# Altium project RF-UNIT-BIG-100W.PrjPcb
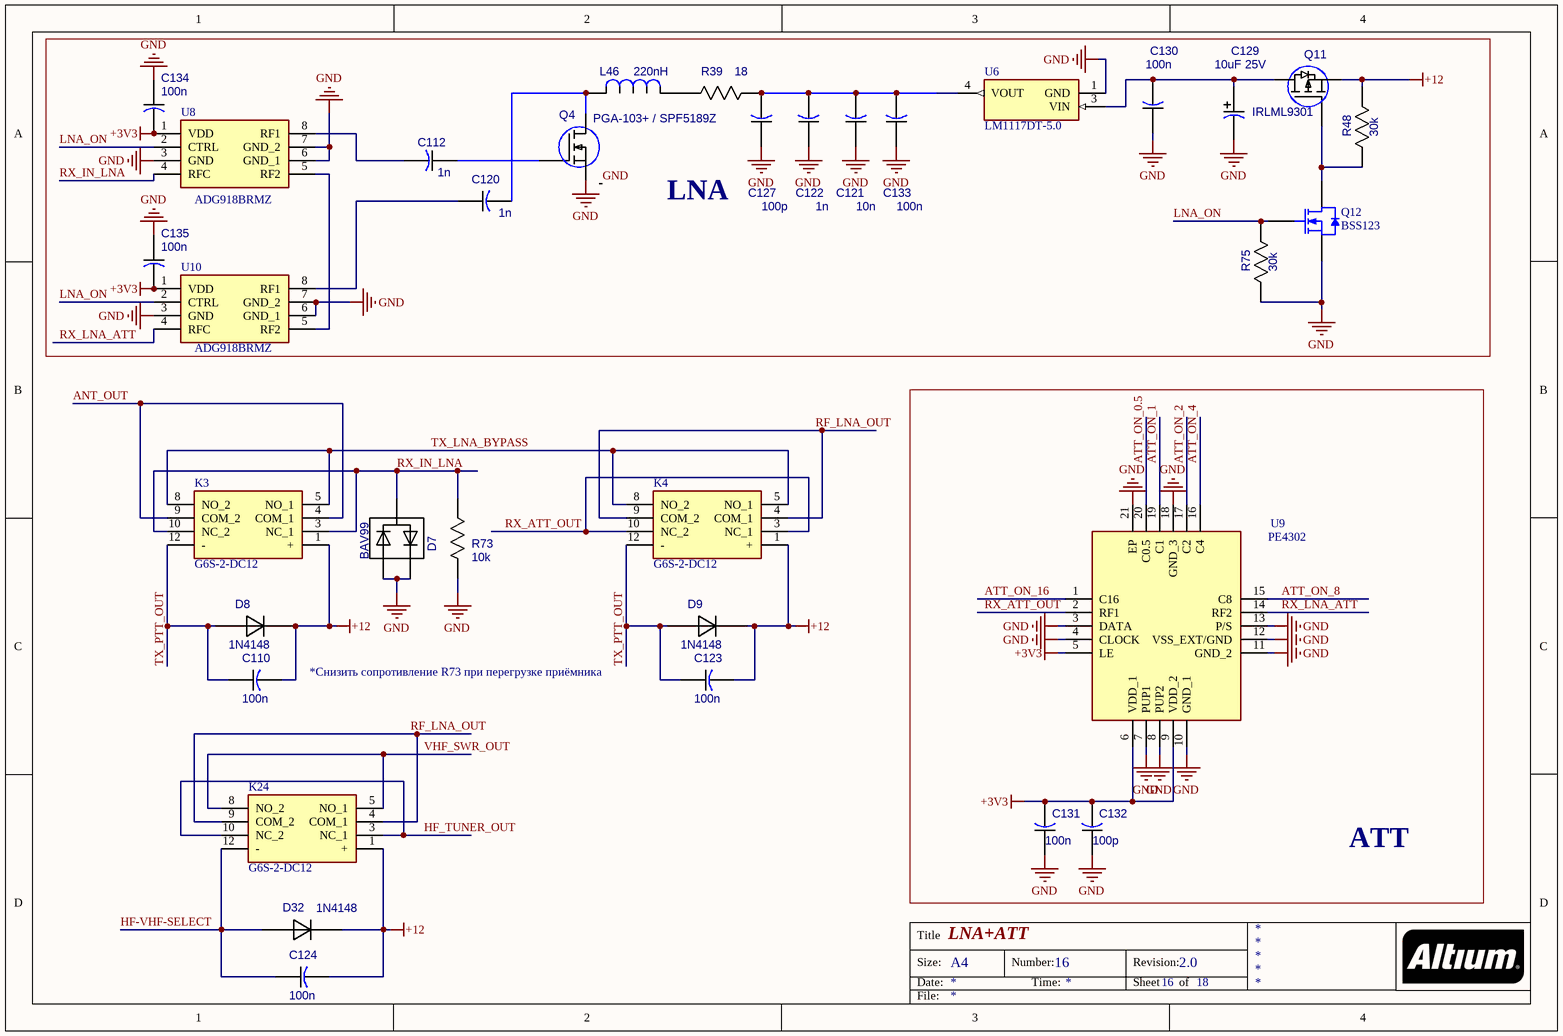
[diagram p0: LNA.SchDoc]
5 sheets, 215 parts. Net scope: global (net labels, ports and power ports of the same name join across sheets).
Board file: RF-UNIT-BIG-100W.PcbDoc
Sheets:
  LNA.SchDoc
  HF_TUNER.SchDoc
  HF_AMP.SchDoc
  HF_AMP_DRIVER.SchDoc
  VHF_AMP.SchDoc

## Sheet LNA.SchDoc: LNA+ATT
size A4; DocumentNumber: 16; Revision: 2.0; SheetNumber: 16; SheetTotal: 18

### Parts
C110  100n  [CAP_0805]
C112  1n  [CAP_0805]
C120  1n  [CAP_0805]
C121  10n  [6-0805_M]
C122  1n  [6-0805_M]
C123  100n  [CAP_0805]
C124  100n  [CAP_0805]
C127  100p  [6-0805_M]
C129  10uF 25V  [CAPAE_5.3x5.3h6.1]
C130  100n  [CAP_0805]
C131  100n  [6-0805_M]
C132  100p  [6-0805_M]
C133  100n  [CAP_0805]
C134  100n  [CAP_0805]
C135  100n  [CAP_0805]
D7  BAV99  [SOT23]
D8  1N4148  [SS14]
D9  1N4148  [SS14]
D32  1N4148  [SS14]
K3  G6S-2-DC12  [G6S2DC12]
K4  G6S-2-DC12  [G6S2DC12]
K24  G6S-2-DC12  [G6S2DC12]
L46  220nH  [IND_1206]
Q4  PGA-103+ / SPF5189Z  [SOT89]
Q11  IRLML9301  [SOT23]
Q12  BSS123  [FAIR-SOT23-3_V]
R39  18  [RES_1206]
R48  30k  [RES_0805]
R73  10k  [RES_1206]
R75  30k  [RES_0805]
U6  LM1117DT-5.0  [TO228P991X238-3N]
U8  ADG918BRMZ  [SOP65P490X110-8N]
U9  PE4302  [QFN50P400X400X90-21N]
U10  ADG918BRMZ  [SOP65P490X110-8N]

### Blocks framed on the sheet
LNA: C112 C120-C122 C127 C129 C130 C133-C135 L46 Q4 Q11 Q12 R39 R48 R75 U6 U8 U10
ATT: C131 C132 U9

### Nets
+3V3: C131.2 C132.2 C134.2 C135.2 U8.1(VDD) U9.5(LE) U9.6(VDD_1) U9.9(VDD_2) U10.1(VDD)
GND: C110.2 C121.1 C122.1 C123.2 C124.2 C127.1 C129.2(MINUS) C130.1 C131.1 C132.1 C133.1 C134.1 C135.1 D7.1(A(D1)) D7.2(C(D2)) D8.1(K) D9.1(K) D32.1(K) K3.1(+) K4.1(+) K24.1(+) Q4.0 Q4.2(S) Q11.2(S) Q12.2(S) R48.2 R73.1 R75.1 U6.1(GND) U8.3(GND) U8.6(GND_1) U8.7(GND_2) U9.3(DATA) U9.4(CLOCK) U9.7(PUP1) U9.8(PUP2) U9.10(GND_1) U9.11(GND_2) U9.12(VSS_EXT/GND) U9.13(P/S) U9.18(GND_3) U9.21(EP) U10.3(GND) U10.6(GND_1) U10.7(GND_2)  [also labelled +12]
ANT_OUT: K3.4(COM_1) K3.9(COM_2)
ATT_ON_0.5: U9.20(C0.5)
ATT_ON_1: U9.19(C1)
ATT_ON_2: U9.17(C2)
ATT_ON_4: U9.16(C4)
ATT_ON_8: U9.15(C8)
ATT_ON_16: U9.1(C16)
HF-VHF-SELECT: C124.1 D32.2(A) K24.12(-)
HF_TUNER_OUT: K24.3(NC_1) K24.10(NC_2)
LNA_ON: Q12.1(G) R75.2 U8.2(CTRL) U10.2(CTRL)
RF_LNA_OUT: K4.4(COM_1) K4.9(COM_2) K24.4(COM_1) K24.9(COM_2)
RX_ATT_OUT: K4.3(NC_1) K4.10(NC_2) U9.2(RF1)
RX_IN_LNA: D7.3(C(D1),A(D2)) K3.3(NC_1) K3.10(NC_2) R73.2 U8.4(RFC)
RX_LNA_ATT: U9.14(RF2) U10.4(RFC)
TX_LNA_BYPASS: K3.5(NO_1) K3.8(NO_2) K4.5(NO_1) K4.8(NO_2)
TX_PTT_OUT: C110.1 C123.1 D8.2(A) D9.2(A) K3.12(-) K4.12(-)
VHF_SWR_OUT: K24.5(NO_1) K24.8(NO_2)
NetC112_1: C112.1 Q4.1(G)
NetC112_2: C112.2 U8.8(RF1)
NetC120_1: C120.1 U10.8(RF1)
NetC120_2: C120.2 L46.2 Q4.3(D)
NetC121_2: C121.2 C122.2 C127.2 C133.2 R39.1 U6.4(VOUT)
NetC129_1: C129.1(PLUS) C130.2 Q11.3(D) U6.3(VIN)
NetL46_1: L46.1 R39.2
NetQ11_1: Q11.1(G) Q12.3(D) R48.1
NetU8_5: U8.5(RF2) U10.5(RF2)

### Notes on the sheet
- *Снизить сопротивление R73 при перегрузке приёмника
- Title
- Size:
- Date:
- A4
- Number:
- Time:
- Revision:
- Sheet
- of
- File:

### Library data of the parts
C110 C112 C120-C124 C127 C130-C135 = CAP_0805
  C121: Value: 10n
  C122: Value: 1n
  C127 C132: Value: 100p
  C130 C131 C133-C135: Value: 100n
C129 = CAPAE_5.3x5.3h6.1: Value: 10uF 25V
K3 K4 K24 = G6S-2-DC12: Relay or Contactor; Manufacturer_Name: Omron Electronics; Datasheet Link: https://componentsearchengine.com/Datasheets/1/G6S-2-DC12.pdf; Height: 9.4mm; Manufacturer_Part_Number: G6S-2-DC12; Mouser Part Number: 653-G6S-2-DC12A; Mouser Price/Stock: https://www.mouser.co.uk/ProductDetail/Omron-Electronics/G6S-2-DC12/?qs=QGk6feVlqMLN9Ouv0QsFzA%3D%3D
L46 = IND_1206: Value: 220nH
Q4 = PGA-103+
Q11 = MOSFET_ENH_PD: MOSFET; Value: IRLML9301
Q12 = CMP-2000-04934-1: N-Channel Logic Level Enhancement Mode Field Effect Transistor, 1.7 V, -55 to 150 degC, 3-Pin SOT-23, RoHS, Tape and Reel; Manufacturer: Fairchild; Channel Type: N; Typical Turn-Off Delay Time: 17ns; Maximum Continuous Drain Current: 0.17A; Rad Hard: No; Typical Rise Time: 9ns; Typical Fall Time: 2.4ns; Maximum Gate Source Voltage: ±20V; Maximum Drain Source Voltage: 100V; Typical Turn-On Delay Time: 1.7ns; RDS-on: 6000@10VmOhm; Package Version: Rev. 12, 03/2016; Packaging: Tape&Reel; Package Reference: SOT23-3; Channel Mode: Enhancement; Operating Temperature: -55to150degC; Package Description: 3-Pin Small Outline Transistor, Body 2.92 x 1.325 mm, Pitch 0.95 mm; Category: MOSFET; Datasheet Version: Jun-03; Datasheet URL: https://www.fairchildsemi.com/datasheets/BS/BSS123.pdf; Manufacturer URL: https://www.fairchildsemi.com/; Mounting: SurfaceMount; Package: 3SOT-23; Package URL: http://www.fairchildsemi.com/dwg/MA/MA03D.pdf
R39 R73 = RES_1206
  R39: Value: 18
R48 R75 = RES_0805: Value: 30k
U6 = LM1117DT-ADJ: Integrated Circuit; Manufacturer_Name: Texas Instruments; Datasheet Link: http://www.ti.com/lit/ds/symlink/lm1117-n.pdf; Height: 2.38mm; Manufacturer_Part_Number: LM1117DT-ADJ; Mouser Part Number: 926-LM1117DT-ADJ; Mouser Price/Stock: https://www.mouser.com/Search/Refine.aspx?Keyword=926-LM1117DT-ADJ
U8 U10 = ADG918BRMZ: Integrated Circuit; Manufacturer_Name: Analog Devices; Datasheet Link: http://www.analog.com/static/imported-files/data_sheets/ADG918_919.pdf; Height: 1.1mm; Manufacturer_Part_Number: ADG918BRMZ; Mouser Part Number: 584-ADG918BRMZ; Mouser Price/Stock: https://www.mouser.co.uk/ProductDetail/Analog-Devices/ADG918BRMZ?qs=BpaRKvA4VqHrp1TCwMhfnw%3D%3D; RS Part Number: 4969212P; RS Price/Stock: http://uk.rs-online.com/web/p/products/4969212P
U9 = PE4312C-Z: Integrated Circuit; Manufacturer_Name: pSemi; Datasheet Link: https://www.psemi.com/pdf/datasheets/pe4312ds.pdf; Height: 0.9mm; Manufacturer_Part_Number: PE4312C-Z; Mouser Part Number: N/A; Mouser Price/Stock: https://www.mouser.com/Search/Refine.aspx?Keyword=N%2FA
D7 = BAV99: Value: BAV99
D8 D9 D32 = 1N4148: Value: *

## Sheet HF_TUNER.SchDoc: HF Tuner
size A4 portrait; DocumentNumber: 18; Revision: 2.0; SheetNumber: 18; SheetTotal: 18
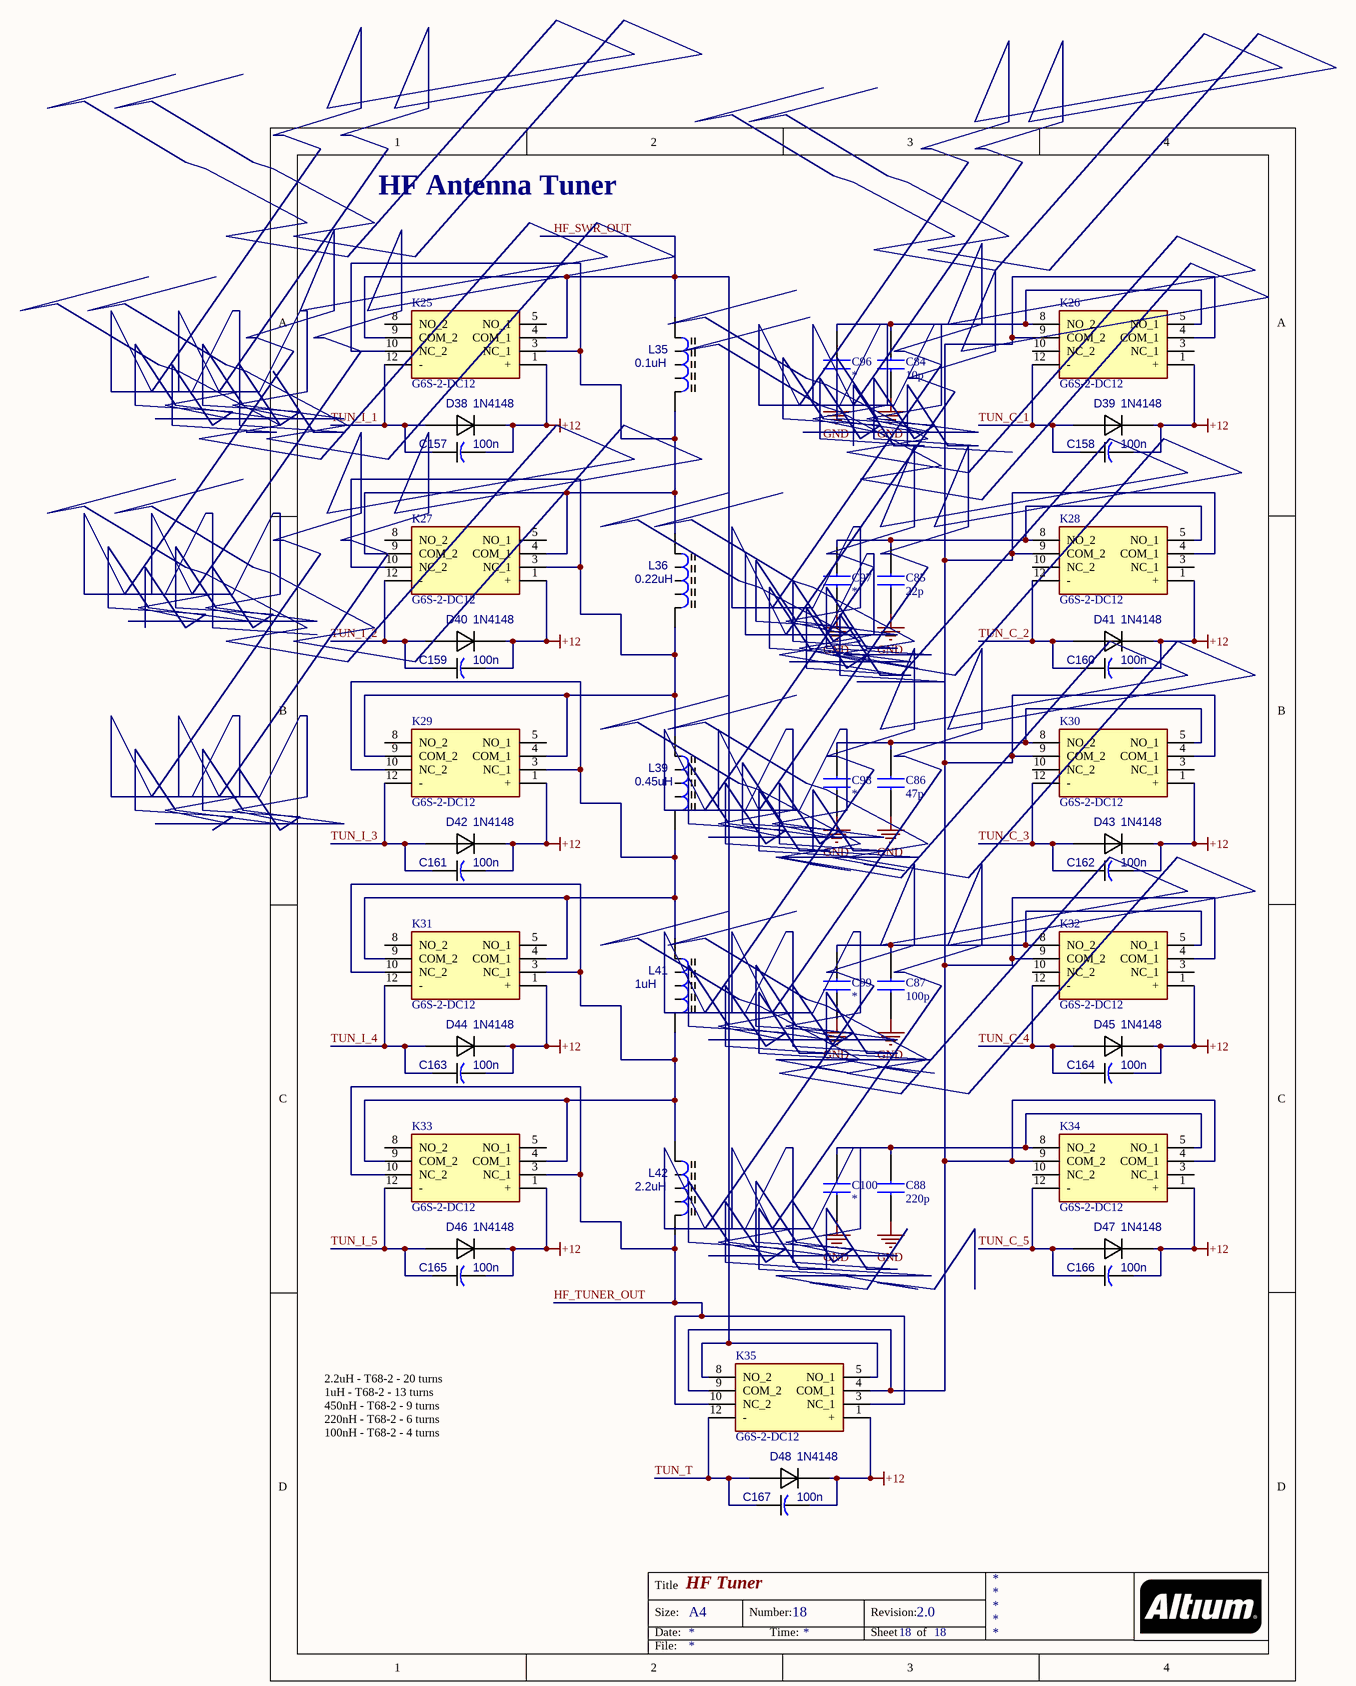
[diagram p1: HF_TUNER.SchDoc]

### Parts
C84  10p  [B32620A0682J000]
C85  22p  [B32620A0682J000]
C86  47p  [B32620A0682J000]
C87  100p  [B32620A0682J000]
C88  220p  [B32620A0682J000]
C96  *  [CAP_1206]
C97  *  [CAP_1206]
C98  *  [CAP_1206]
C99  *  [CAP_1206]
C100  *  [CAP_1206]
C157  100n  [CAP_0805]
C158  100n  [CAP_0805]
C159  100n  [CAP_0805]
C160  100n  [CAP_0805]
C161  100n  [CAP_0805]
C162  100n  [CAP_0805]
C163  100n  [CAP_0805]
C164  100n  [CAP_0805]
C165  100n  [CAP_0805]
C166  100n  [CAP_0805]
C167  100n  [CAP_0805]
D38  1N4148  [SS14]
D39  1N4148  [SS14]
D40  1N4148  [SS14]
D41  1N4148  [SS14]
D42  1N4148  [SS14]
D43  1N4148  [SS14]
D44  1N4148  [SS14]
D45  1N4148  [SS14]
D46  1N4148  [SS14]
D47  1N4148  [SS14]
D48  1N4148  [SS14]
K25  G6S-2-DC12  [G6S2DC12]
K26  G6S-2-DC12  [G6S2DC12]
K27  G6S-2-DC12  [G6S2DC12]
K28  G6S-2-DC12  [G6S2DC12]
K29  G6S-2-DC12  [G6S2DC12]
K30  G6S-2-DC12  [G6S2DC12]
K31  G6S-2-DC12  [G6S2DC12]
K32  G6S-2-DC12  [G6S2DC12]
K33  G6S-2-DC12  [G6S2DC12]
K34  G6S-2-DC12  [G6S2DC12]
K35  G6S-2-DC12  [G6S2DC12]
L35  0.1uH  [IND_FERRITE_CORE_1]
L36  0.22uH  [IND_FERRITE_CORE_1]
L39  0.45uH  [IND_FERRITE_CORE_1]
L41  1uH  [IND_FERRITE_CORE_1]
L42  2.2uH  [IND_FERRITE_CORE_1]

### Nets
GND: C84.1 C84.2 C85.1 C86.1 C87.1 C87.2 C88.1 C88.2 C96.1 C96.2 C97.1 C98.1 C99.1 C99.2 C100.1 C100.2 C157.1 C157.2 C158.2 C159.2 C160.2 C161.2 C162.2 C163.2 C164.2 C165.2 C166.2 C167.2 D38.1(K) D38.2(A) D39.1(K) D40.1(K) D41.1(K) D42.1(K) D43.1(K) D44.1(K) D45.1(K) D46.1(K) D47.1(K) D48.1(K) K25.1(+) K25.3(NC_1) K25.4(COM_1) K25.9(COM_2) K25.10(NC_2) K25.12(-) K26.1(+) K26.4(COM_1) K26.5(NO_1) K26.8(NO_2) K26.9(COM_2) K27.1(+) K27.3(NC_1) K27.4(COM_1) K27.9(COM_2) K27.10(NC_2) K28.1(+) K28.4(COM_1) K28.9(COM_2) K29.1(+) K29.4(COM_1) K29.9(COM_2) K30.1(+) K30.4(COM_1) K30.9(COM_2) K31.1(+) K32.1(+) K32.4(COM_1) K32.5(NO_1) K32.8(NO_2) K32.9(COM_2) K33.1(+) K34.1(+) K34.4(COM_1) K34.5(NO_1) K34.8(NO_2) K34.9(COM_2) K35.1(+) K35.4(COM_1) K35.5(NO_1) K35.8(NO_2) K35.9(COM_2) L35.1(A) L35.2(B) L36.1(A) L36.2(B) L39.1(A)  [also labelled +12, HF_SWR_OUT, TUN_I_1]
HF_TUNER_OUT: K33.3(NC_1) K33.10(NC_2) K35.3(NC_1) K35.10(NC_2) L42.2(B)
TUN_I_2: C159.1 D40.2(A) K27.12(-)
TUN_I_3: C161.1 D42.2(A) K29.12(-)
TUN_I_4: C163.1 D44.2(A) K31.12(-)
TUN_I_5: C165.1 D46.2(A) K33.12(-)
TUN_T: C167.1 D48.2(A) K35.12(-)
TUN_С_1: C158.1 D39.2(A) K26.12(-)
TUN_С_2: C160.1 D41.2(A) K28.12(-)
TUN_С_3: C162.1 D43.2(A) K30.12(-)
TUN_С_4: C164.1 D45.2(A) K32.12(-)
TUN_С_5: C166.1 D47.2(A) K34.12(-)
NetC85_2: C85.2 C97.2 K28.5(NO_1) K28.8(NO_2)
NetC86_2: C86.2 C98.2 K30.5(NO_1) K30.8(NO_2)
NetK29_3: K29.3(NC_1) K29.10(NC_2) K31.4(COM_1) K31.9(COM_2) L39.2(B) L41.1(A)
NetK31_3: K31.3(NC_1) K31.10(NC_2) K33.4(COM_1) K33.9(COM_2) L41.2(B) L42.1(A)

Not connected (* = marked no-connect by the designer): K25 5(NO_1) 8(NO_2); K26 3(NC_1) 10(NC_2); K27 5(NO_1) 8(NO_2); K28 3(NC_1) 10(NC_2); K29 5(NO_1) 8(NO_2); K30 3(NC_1) 10(NC_2); K31 5(NO_1) 8(NO_2); K32 3(NC_1) 10(NC_2); K33 5(NO_1) 8(NO_2); K34 3(NC_1) 10(NC_2)

### Notes on the sheet
- HF Antenna Tuner
- 2.2uH - T68-2 - 20 turns
  1uH - T68-2 - 13 turns
  450nH - T68-2 - 9 turns
  220nH - T68-2 - 6 turns
  100nH - T68-2 - 4 turns
- Title
- Size:
- Date:
- A4
- Number:
- Time:
- Revision:
- Sheet
- of
- File:

### Library data of the parts
C84-C88 = B32620A0682J000: Capacitor; Manufacturer_Name: TDK; Datasheet Link: https://www.tdk-electronics.tdk.com/inf/20/20/db/fc_2009/MKP_B32620_621.pdf; Height: 12mm; Manufacturer_Part_Number: B32620A0682J000; Mouser Part Number: 871-B32620A682J; Mouser Price/Stock: https://www.mouser.com/Search/Refine.aspx?Keyword=871-B32620A682J
C96-C100 = B32620A0682J000: Capacitor NP0 HiVolt; Manufacturer_Name: TDK; Datasheet Link: https://www.tdk-electronics.tdk.com/inf/20/20/db/fc_2009/MKP_B32620_621.pdf; Height: 12mm; Manufacturer_Part_Number: B32620A0682J000; Mouser Part Number: 871-B32620A682J; Mouser Price/Stock: https://www.mouser.com/Search/Refine.aspx?Keyword=871-B32620A682J
C157-C167 = CAP_0805
K25-K35 = G6S-2-DC12: as K3 on sheet LNA; Datasheet Link: https://componentsearchengine.com/Datasheets/1/G6S-2-DC12.pdf; Height: 9.4mm; Manufacturer_Part_Number: G6S-2-DC12; Mouser Part Number: 653-G6S-2-DC12A; Mouser Price/Stock: https://www.mouser.co.uk/ProductDetail/Omron-Electronics/G6S-2-DC12/?qs=QGk6feVlqMLN9Ouv0QsFzA%3D%3D
L35 L36 L39 L41 L42 = IND_FERRITE_CORE: Inductor
D38-D48 = 1N4148: Value: *

## Sheet HF_AMP.SchDoc: HF RF AMP
size A4; DocumentNumber: 17; Revision: 2.0; SheetNumber: 17; SheetTotal: 18
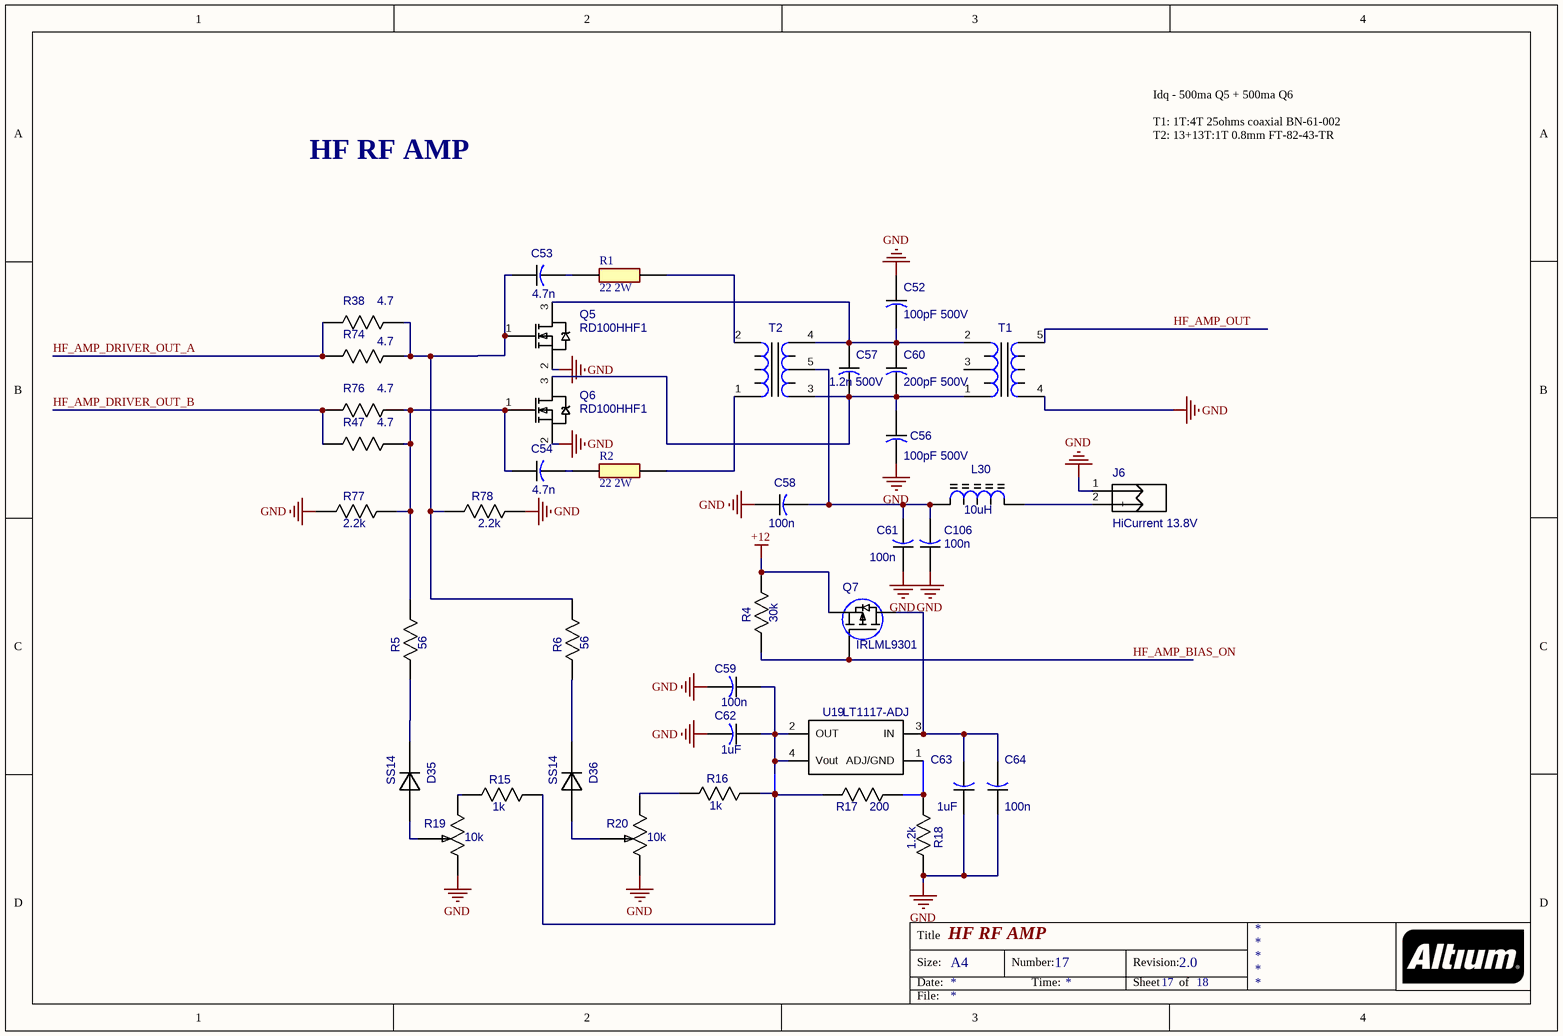
[diagram p2: HF_AMP.SchDoc]

### Parts
C52  100pF 500V  [CAP_1206]
C53  4.7n  [CAP_1206]
C54  4.7n  [CAP_1206]
C56  100pF 500V  [CAP_1206]
C57  1.2n 500V  [CAP_1206]
C58  100n  [CAP_1206]
C59  100n  [CAP_0805]
C60  200pF 500V  [CAP_1206]
C61  100n  [CAP_1206]
C62  1uF  [CAP_0805]
C63  1uF  [CAP_0805]
C64  100n  [CAP_0805]
C106  100n  [CAP_1206]
D35  SS14  [SS14]
D36  SS14  [SS14]
J6  HiCurrent 13.8V  [1986717-2]
L30  10uH  [IND_FERRITE_CORE]
Q5  RD100HHF1  [RD100_V2]
Q6  RD100HHF1  [RD100_V2]
Q7  IRLML9301  [SOT23]
R1  22 2W  [RES-2W]
R2  22 2W  [RES-2W]
R4  30k  [RES_0805]
R5  56  [RES_0805]
R6  56  [RES_0805]
R15  1k  [RES_0805]
R16  1k  [RES_0805]
R17  200  [RES_0805]
R18  1.2k  [RES_0805]
R19  value 10k  [306J]  (hidden comment: ADJ-10k)
R20  value 10k  [306J]  (hidden comment: ADJ-10k)
R38  4.7  [RES_1206]
R47  4.7  [RES_1206]
R74  4.7  [RES_1206]
R76  4.7  [RES_1206]
R77  2.2k  [RES_0805]
R78  2.2k  [RES_0805]
T1  TRANSF_HF2  [TRANSF_HF2-3]  (value not drawn)
T2  TRANSF_HF1  [TRANSF_HF1]  (value not drawn)
U19  value LT1117-ADJ  [LT1117IST-ADJ]  (hidden comment: LT1117IST-ADJ)

### Nets
GND: C52.1 C56.2 C58.1 C59.2 C61.1 C62.2 C63.1 C64.1 C106.1 J6.1(-) Q5.2(S) Q6.2(S) Q7.2(S) R4.2 R18.2 R19.1(CCW) R20.1(CCW) R77.1 R78.2 T1.4(S1)  [also labelled +12]
HF_AMP_BIAS_ON: Q7.1(G) R4.1
HF_AMP_DRIVER_OUT_A: R38.1 R74.1
HF_AMP_DRIVER_OUT_B: R47.1 R76.1
HF_AMP_OUT: T1.5(S2)
NetC52_2: C52.2 C57.1 C60.1 Q5.3(D) T1.2(P2) T2.4(S2)
NetC53_1: C53.1 Q5.1(G) R6.2 R38.2 R74.2 R78.1
NetC53_2: C53.2 R1.1
NetC54_1: C54.1 Q6.1(G) R5.2 R47.2 R76.2 R77.2
NetC54_2: C54.2 R2.1
NetC56_1: C56.1 C57.2 C60.2 Q6.3(D) T1.1(P1) T2.3(S1)
NetC58_2: C58.2 C61.2 C106.2 L30.1(A) T2.5(S3)
NetC59_1: C59.1 C62.1 R15.2 R16.2 R17.1 U19.2(OUT) U19.4(Vout)
NetC63_2: C63.2 C64.2 Q7.3(D) U19.3(IN)
NetD35_1: D35.1(K) R5.1
NetD35_2: D35.2(A) R19.2(W)
NetD36_1: D36.1(K) R6.1
NetD36_2: D36.2(A) R20.2(W)
NetJ6_2: J6.2(+) L30.2(B)
NetR1_2: R1.2 T2.2(P2)
NetR2_2: R2.2 T2.1(P1)
NetR15_1: R15.1 R19.3(CW)
NetR16_1: R16.1 R20.3(CW)
NetR17_2: R17.2 R18.1 U19.1(ADJ/GND)

Not connected (* = marked no-connect by the designer): T1 3(P3)

### Notes on the sheet
- HF RF AMP
- Idq - 500ma Q5 + 500ma Q6
  T1: 1T:4T 25ohms coaxial BN-61-002
  T2: 13+13T:1T 0.8mm FT-82-43-TR
- Title
- Size:
- Date:
- A4
- Number:
- Time:
- Revision:
- Sheet
- of
- File:

### Library data of the parts
C52-C54 C56-C58 C60 C61 C106 = CAP_1206
C59 C62-C64 = CAP_0805
  C59 C64: Value: 100n
  C62 C63: Value: 1uF
J6 = 1986717-2: JX2
L30 = IND_FERRITE_CORE: Inductor; Value: 10uH
Q7 = MOSFET_ENH_PD: MOSFET; Value: IRLML9301
R1 R2 = CFR200J100R: Manufacturer_Name: TE Connectivity; Datasheet Link: http://www.te.com/commerce/DocumentDelivery/DDEController?Action=showdoc&DocId=Data+Sheet%7F1773195%7FE%7Fpdf%7FEnglish%7FENG_DS_1773195_E.pdf%7F1623929-2; Manufacturer_Part_Number: CFR200J100R; Mouser Part Number: 279-CFR200J100R; Mouser Price/Stock: https://www.mouser.com/Search/Refine.aspx?Keyword=279-CFR200J100R; Arrow Part Number: CFR200J100R; Arrow Price/Stock: https://www.arrow.com/en/products/cfr200j100r/te-connectivity
R4-R6 R15-R18 R77 R78 = RES_0805
  R4: Value: 30k
  R5 R6: Value: 56
  R15 R16: Value: 1k
  R17: Value: 200
  R18: Value: 1.2k
R19 R20 = 306J
R38 R47 R74 R76 = RES_1206
T1 = TRANSF_RF2: Value: *
T2 = TRANSF_RF1: Value: *
D35 D36 = SS14: Value: SS14
Q5 Q6 = RD100HHF1: Value: RD100HHF1

## Sheet HF_AMP_DRIVER.SchDoc: HF RF AMP DRIVER
size A4; DocumentNumber: 17; Revision: 2.0; SheetNumber: 17; SheetTotal: 18
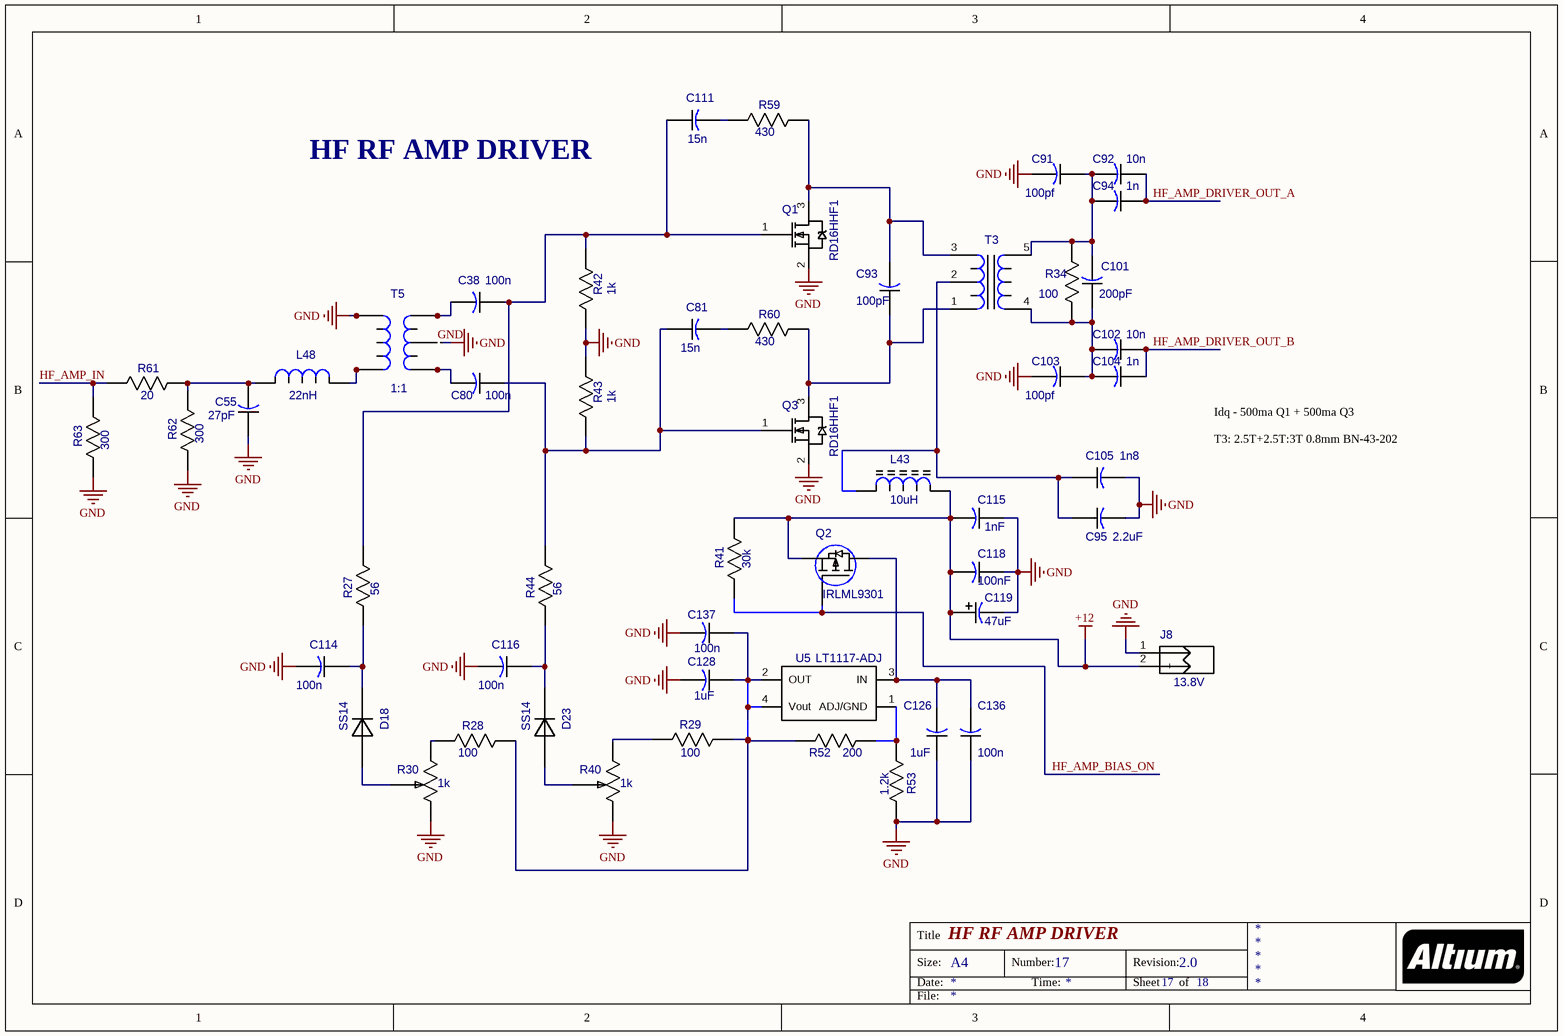
[diagram p3: HF_AMP_DRIVER.SchDoc]

### Parts
C38  100n  [CAP_0805]
C55  27pF  [CAP_0805]
C80  100n  [CAP_0805]
C81  15n  [CAP_1206]
C91  100pf  [CAP_1206]
C92  10n  [CAP_1206]
C93  100pF  [CAP_1206]
C94  1n  [CAP_1206]
C95  2.2uF  [CAP_1206]
C101  200pF  [CAP_1206]
C102  10n  [CAP_1206]
C103  100pf  [CAP_1206]
C104  1n  [CAP_1206]
C105  1n8  [CAP_1206]
C111  15n  [CAP_1206]
C114  100n  [CAP_0805]
C115  1nF  [CAP_0805]
C116  100n  [CAP_0805]
C118  100nF  [CAP_0805]
C119  47uF  [CAPAE_6.6x6.6h5.4]
C126  1uF  [CAP_0805]
C128  1uF  [CAP_0805]
C136  100n  [CAP_0805]
C137  100n  [CAP_0805]
D18  SS14  [SS14]
D23  SS14  [SS14]
J8  13.8V  [1986717-2]
L43  10uH  [IND_FERRITE_CORE]
L48  22nH  [IND_0805]
Q1  RD16HHF1  [RD16_V2]
Q2  IRLML9301  [SOT23]
Q3  RD16HHF1  [RD16_V2]
R27  56  [RES_0805]
R28  100  [RES_0805]
R29  100  [RES_0805]
R30  value 1k  [306J]  (hidden comment: ADJ-1k)
R34  100  [RES_1206]
R40  value 1k  [306J]  (hidden comment: ADJ-1k)
R41  30k  [RES_0805]
R42  1k  [RES_0805]
R43  1k  [RES_0805]
R44  56  [RES_0805]
R52  200  [RES_0805]
R53  1.2k  [RES_0805]
R59  430  [RES_1206]
R60  430  [RES_1206]
R61  20  [RES_1206]
R62  300  [RES_1206]
R63  300  [RES_1206]
T3  TRANSF_HF3  [TRANSF_HF3]  (value not drawn)
T5  1:1  [TRANSF_ACORE2]
U5  value LT1117-ADJ  [LT1117IST-ADJ]  (hidden comment: LT1117IST-ADJ)

### Nets
GND: C55.1 C91.2 C95.2 C103.2 C105.2 C114.2 C115.1 C115.2 C116.2 C118.1 C118.2 C119.1(PLUS) C119.2(MINUS) C126.1 C128.2 C136.1 C137.2 J8.1(-) J8.2(+) L43.2(B) Q1.2(S) Q2.2(S) Q3.2(S) R30.1(CCW) R40.1(CCW) R41.2 R42.1 R43.2 R53.2 R62.1 R63.1 T5.2(S2) T5.4(P2) T5.8(S2) T5.11  [also labelled +12]
HF_AMP_BIAS_ON: Q2.1(G) R41.1
HF_AMP_DRIVER_OUT_A: C92.1 C94.1
HF_AMP_DRIVER_OUT_B: C102.1 C104.1
HF_AMP_IN: R61.1 R63.2
NetC38_1: C38.1 C111.1 Q1.1(G) R27.2 R42.2
NetC38_2: C38.2 T5.3(S3) T5.9
NetC55_2: C55.2 L48.1 R61.2 R62.2
NetC80_1: C80.1 C81.1 Q3.1(G) R43.1 R44.2
NetC80_2: C80.2 T5.1(S1) T5.7
NetC81_2: C81.2 R60.1
NetC91_1: C91.1 C92.2 C94.2 C101.2 R34.2 T3.5(P1)
NetC93_1: C93.1 Q3.3(D) R60.2 T3.1(S2)
NetC93_2: C93.2 Q1.3(D) R59.2 T3.3(S1)
NetC95_1: C95.1 C105.1 L43.1(A) T3.2(S3)
NetC101_1: C101.1 C102.2 C103.1 C104.2 R34.1 T3.4(P2)
NetC111_2: C111.2 R59.1
NetC114_1: C114.1 D18.1(K) R27.1
NetC116_1: C116.1 D23.1(K) R44.1
NetC126_2: C126.2 C136.2 Q2.3(D) U5.3(IN)
NetC128_1: C128.1 C137.1 R28.2 R29.2 R52.1 U5.2(OUT) U5.4(Vout)
NetD18_2: D18.2(A) R30.2(W)
NetD23_2: D23.2(A) R40.2(W)
NetL48_2: L48.2 T5.6(P1) T5.10
NetR28_1: R28.1 R30.3(CW)
NetR29_1: R29.1 R40.3(CW)
NetR52_2: R52.2 R53.1 U5.1(ADJ/GND)

### Notes on the sheet
- HF RF AMP DRIVER
- Idq - 500ma Q1 + 500ma Q3
  T3: 2.5T+2.5T:3T 0.8mm BN-43-202
- Title
- Size:
- Date:
- A4
- Number:
- Time:
- Revision:
- Sheet
- of
- File:

### Library data of the parts
C38 C55 C80 C114-C116 C118 C126 C128 C136 C137 = CAP_0805
  C114 C116 C136 C137: Value: 100n
  C115: Value: 1nF
  C118: Value: 100nF
  C126 C128: Value: 1uF
C81 C91-C95 C101-C105 C111 = CAP_1206
C119 = CAPAE_6.6x6.6h5.4: Value: 47uF
J8 = 1986717-2: JX2; Value: 13.8V
L43 = IND_FERRITE_CORE: Inductor; Value: 10uH
L48 = IND_0805
Q2 = MOSFET_ENH_PD: MOSFET; Value: IRLML9301
R27-R29 R41-R44 R52 R53 = RES_0805
  R27 R44: Value: 56
  R41: Value: 30k
  R42 R43: Value: 1k
  R52: Value: 200
  R53: Value: 1.2k
R30 R40 = 306J
R34 R59-R63 = RES_1206
T3 = TRANSF_RF3: Value: *
T5 = TRANSF_ACORE2: Value: 1:1
D18 D23 = SS14: Value: SS14
Q1 Q3 = RD16HHF1: Value: RD16HHF1

## Sheet VHF_AMP.SchDoc: VHF RF AMP
size A4; DocumentNumber: 17; Revision: 2.0; SheetNumber: 17; SheetTotal: 18
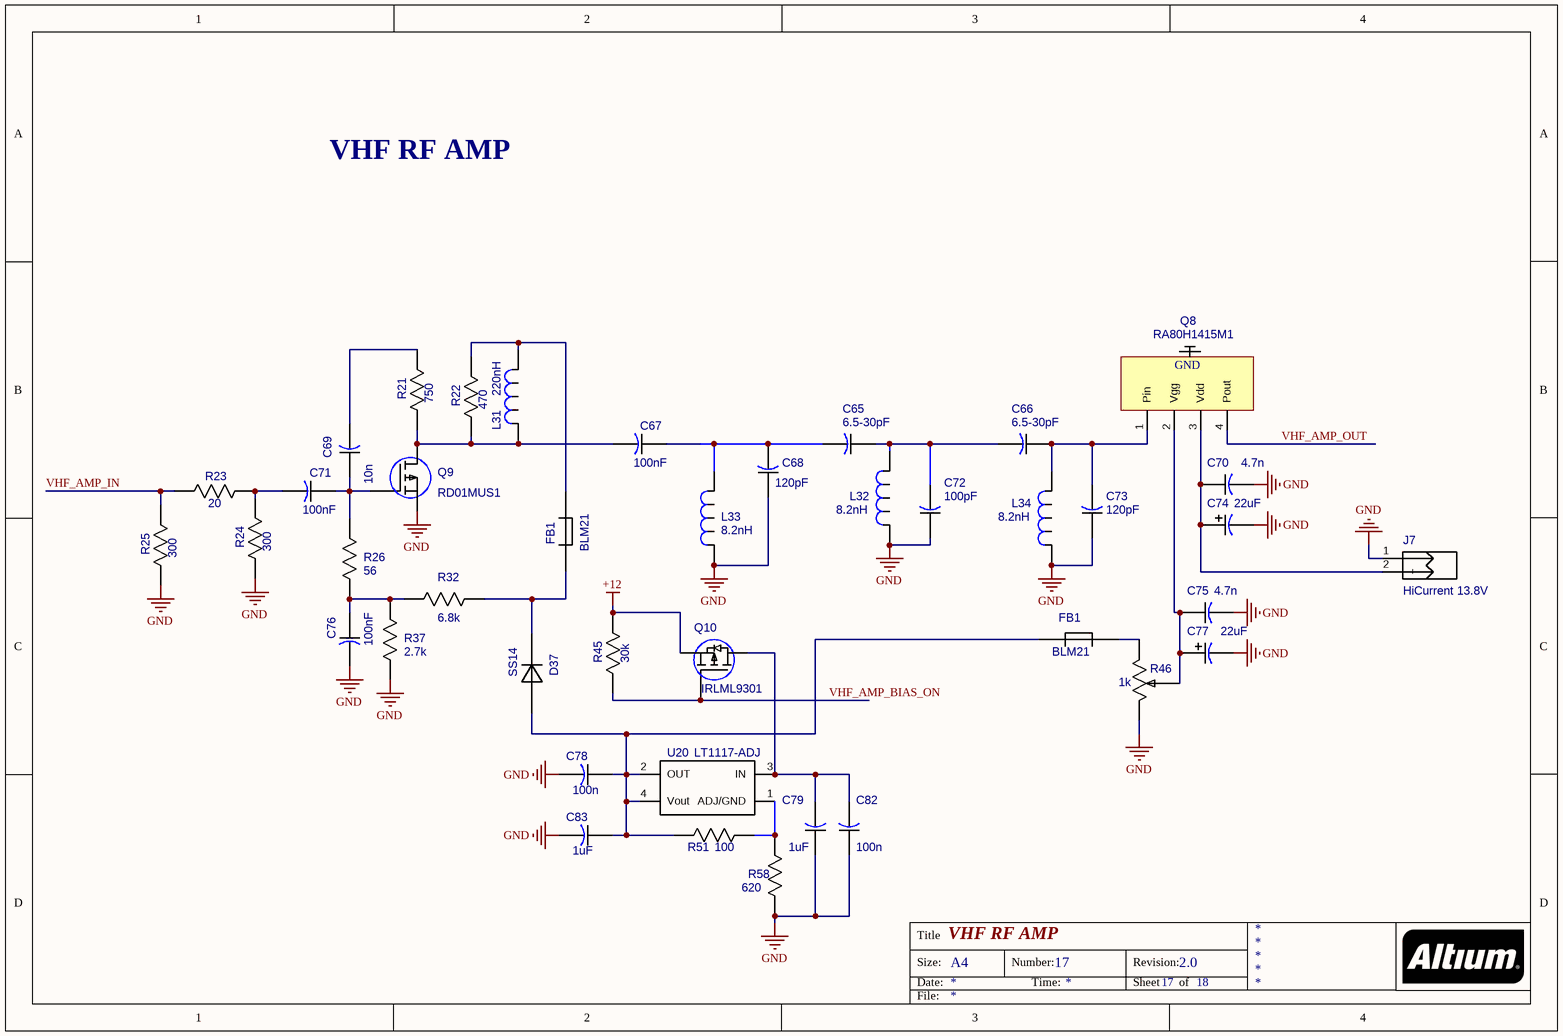
[diagram p4: VHF_AMP.SchDoc]

### Parts
(Parts that share a designator on the sheet are numbered #1, #2 ... from top to bottom, then left to right.)
C65  6.5-30pF  [5025[2010]]
C66  6.5-30pF  [5025[2010]]
C67  100nF  [CAP_0805]
C68  120pF  [CAP_0805]
C69  10n  [CAP_1206]
C70  4.7n  [CAP_0805]
C71  100nF  [CAP_0805]
C72  100pF  [CAP_0805]
C73  120pF  [CAP_0805]
C74  22uF  [CAPAE_6.6x6.6h5.4]
C75  4.7n  [CAP_0805]
C76  100nF  [CAP_0805]
C77  22uF  [CAPAE_6.6x6.6h5.4]
C78  100n  [CAP_0805]
C79  1uF  [CAP_0805]
C82  100n  [CAP_0805]
C83  1uF  [CAP_0805]
D37  SS14  [SS14]
FB1#1  BLM21  [IND_0805]
FB1#2  BLM21  [IND_0805]
J7  HiCurrent 13.8V  [1986717-2]
L31  value 220nH  [IND_1206]  (hidden comment: 10uH)
L32  8.2nH  [IND_0805]
L33  8.2nH  [IND_0805]
L34  8.2nH  [IND_0805]
Q8  RA80H1415M1  [RA80H1415M1]
Q9  RD01MUS1  [SOT89]
Q10  IRLML9301  [SOT23]
R21  750  [RES_1206]
R22  470  [RES_1206]
R23  20  [RES_1206]
R24  300  [RES_1206]
R25  300  [RES_1206]
R26  56  [RES_0805]
R32  6.8k  [RES_0805]
R37  2.7k  [RES_0805]
R45  30k  [RES_0805]
R46  value 1k  [306J]  (hidden comment: ADJ-1k)
R51  100  [RES_0805]
R58  620  [RES_0805]
U20  value LT1117-ADJ  [LT1117IST-ADJ]  (hidden comment: LT1117IST-ADJ)

### Nets
GND: C68.1 C70.2 C72.1 C73.1 C74.2(MINUS) C75.2 C76.2 C77.2(MINUS) C78.2 C79.1 C82.1 C83.2 J7.1(-) L32.1 L33.1 L34.1 Q9.2(S) Q10.2(S) R24.1 R25.1 R37.1 R45.2 R46.1(CCW) R58.2  [also labelled +12]
VHF_AMP_BIAS_ON: Q10.1(G) R45.1
VHF_AMP_IN: R23.1 R25.2
VHF_AMP_OUT: Q8.4(Pout)
NetC65_1: C65.1 C66.2 C72.2 L32.2
NetC65_2: C65.2 C67.1 C68.2 L33.2
NetC66_1: C66.1 C73.2 L34.2 Q8.1(Pin)
NetC67_2: C67.2 L31.2 Q9.3(D) R21.1 R22.1
NetC69_1: C69.1 C71.1 Q9.1(G) R26.2
NetC69_2: C69.2 R21.2
NetC70_1: C70.1 C74.1(PLUS) J7.2(+) Q8.3(Vdd)
NetC71_2: C71.2 R23.2 R24.2
NetC75_1: C75.1 C77.1(PLUS) Q8.2(Vgg) R46.2(W)
NetC76_1: C76.1 R26.1 R32.2 R37.2
NetC78_1: C78.1 C83.1 D37.2(A) FB1#2.1 R51.1 U20.2(OUT) U20.4(Vout)
NetC79_2: C79.2 C82.2 Q10.3(D) U20.3(IN)
NetD37_1: D37.1(K) FB1#1.2 R32.1
NetFB1#1_1: FB1#1.1 L31.1 R22.2
NetFB1#2_2: FB1#2.2 R46.3(CW)
NetR51_2: R51.2 R58.1 U20.1(ADJ/GND)

### Notes on the sheet
- VHF RF AMP
- Title
- Size:
- Date:
- A4
- Number:
- Time:
- Revision:
- Sheet
- of
- File:
- (in symbol RA80H1415M1) GND

### Library data of the parts
C65 C66 = CAP_0805: TZC3P300A110; Value: 6.5-30pF
C67 C68 C70-C73 C75 C76 C78 C79 C82 C83 = CAP_0805
  C67 C71 C76: Value: 100nF
  C68 C73: Value: 120pF
  C72: Value: 100pF
  C78 C82: Value: 100n
  C79 C83: Value: 1uF
C69 = CAP_1206
C74 C77 = CAPAE_6.6x6.6h5.4
FB1#1 FB1#2 = IND_FERRITE_BEAD: Value: *
J7 = 1986717-2: JX2
L31 = IND_1206
L32-L34 = IND_0805: Value: 8.2nH
Q10 = MOSFET_ENH_PD: MOSFET; Value: IRLML9301
R21-R25 = RES_1206
R26 R32 R37 R45 R51 R58 = RES_0805
  R45: Value: 30k
R46 = 306J
D37 = SS14: Value: SS14
Q8 = RA80H1415M1: Value: *
Q9 = RD01MUS1: Value: *

## Nets that join several sheets
GND: LNA (45 pins), HF_TUNER (87 pins), HF_AMP (20 pins), HF_AMP_DRIVER (35 pins), VHF_AMP (24 pins)
HF_AMP_BIAS_ON: HF_AMP (Q7.1 R4.1), HF_AMP_DRIVER (Q2.1 R41.1)
HF_AMP_DRIVER_OUT_A: HF_AMP (R38.1 R74.1), HF_AMP_DRIVER (C92.1 C94.1)
HF_AMP_DRIVER_OUT_B: HF_AMP (R47.1 R76.1), HF_AMP_DRIVER (C102.1 C104.1)
HF_TUNER_OUT: LNA (K24.3 K24.10), HF_TUNER (5 pins)